# Altium schematic sheet Hardware.SchDoc
size A4; Organization: Q-Tech Design; Address1: Da Nang City; Address2: Viet Nam; DocumentNumber: 6; SheetNumber: 6; SheetTotal: 7
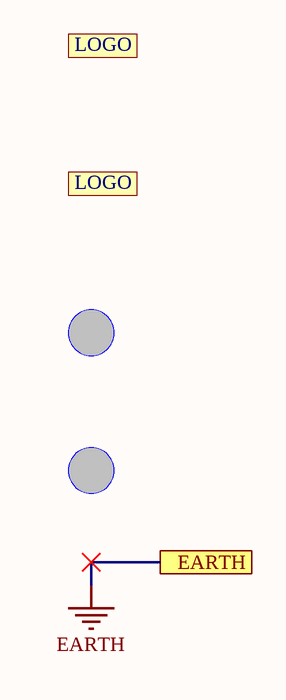
[diagram p0: Hardware.SchDoc]

## Parts
HOLE1  HOLE  [HOLE M3]  (value not drawn)
HOLE2  HOLE  [HOLE M3]  (value not drawn)
LOGO1  LOGO  [LOGO-QTECH]  (value not drawn)
LOGO2  LOGO  [LOGO-QTECH]  (value not drawn)

## Ports
EARTH

## Notes on the sheet
- Page Title:
- Date:
- Title:
- DRE:
- Time:
- Number:
- Sheet
- Rev:
- of
- Q-Tech confidential and proprietary. Restricted access under NDA. Do not reproduce. Store and dispose securely.

## Nets
EARTH: port EARTH

## Library data of the parts
HOLE1 HOLE2 = HOLE M3